# EAGLE schematic sumo1 (EAGLE 8.3.2)
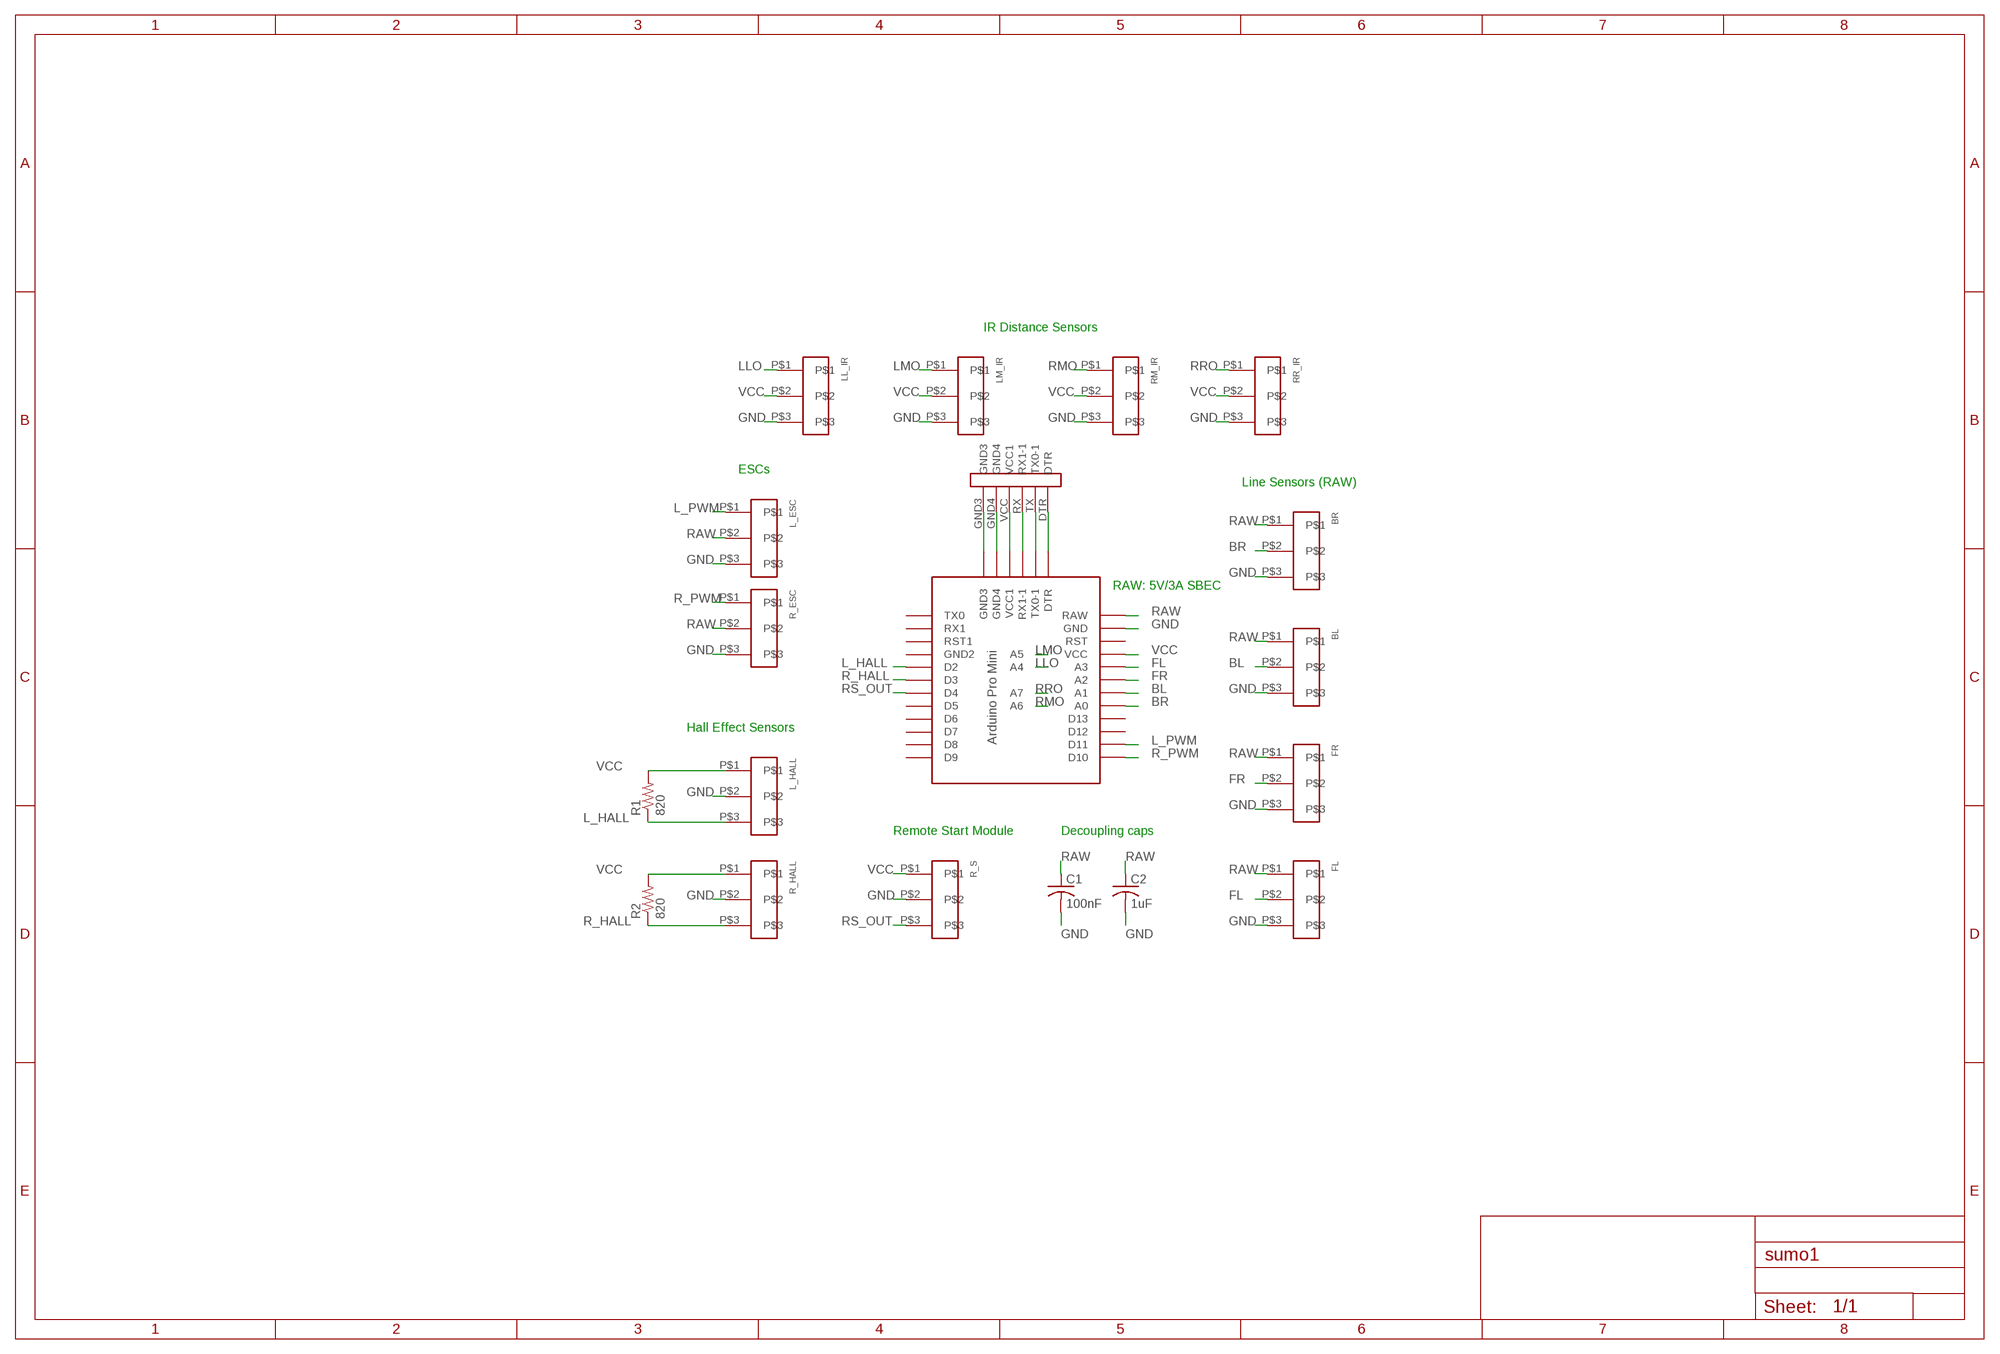
[diagram p0: schematic, sheet 1]

## Parts
BL  PHOENIX_CONTACT_3PIN  [PHOENIX_CONTACT_3PIN]
BR  PHOENIX_CONTACT_3PIN  [PHOENIX_CONTACT_3PIN]
C1  100nF  C-USC0603  [C0603]
C2  1uF  C-USC0603  [C0603]
FL  PHOENIX_CONTACT_3PIN  [PHOENIX_CONTACT_3PIN]
FR  PHOENIX_CONTACT_3PIN  [PHOENIX_CONTACT_3PIN]
L_ESC  PHOENIX_CONTACT_3PIN  [PHOENIX_CONTACT_3PIN]
L_HALL  PHOENIX_CONTACT_3PIN  [PHOENIX_CONTACT_3PIN]
LL_IR  PHOENIX_CONTACT_3PIN  [PHOENIX_CONTACT_3PIN]
LM_IR  PHOENIX_CONTACT_3PIN  [PHOENIX_CONTACT_3PIN]
R1  820  R-US_R0603  [R0603]
R2  820  R-US_R0603  [R0603]
R_ESC  PHOENIX_CONTACT_3PIN  [PHOENIX_CONTACT_3PIN]
R_HALL  PHOENIX_CONTACT_3PIN  [PHOENIX_CONTACT_3PIN]
R_S  PHOENIX_CONTACT_3PIN  [PHOENIX_CONTACT_3PIN]
RM_IR  PHOENIX_CONTACT_3PIN  [PHOENIX_CONTACT_3PIN]
RR_IR  PHOENIX_CONTACT_3PIN  [PHOENIX_CONTACT_3PIN]
U$1  PRO-MINI-2  [PRO-MINI-2]
U$2  6-PIN  [6-PIN]

## Nets
BL: BL.P$2 U$1.A1
BR: BR.P$2 U$1.A0
FL: FL.P$2 U$1.A3
FR: FR.P$2 U$1.A2
GND: BL.P$3 BR.P$3 C1.2 C2.2 FL.P$3 FR.P$3 L_ESC.P$3 L_HALL.P$2 LL_IR.P$3 LM_IR.P$3 R_ESC.P$3 R_HALL.P$2 R_S.P$2 RM_IR.P$3 RR_IR.P$3 U$1.GND
L_HALL: L_HALL.P$3 R1.1 U$1.D2
L_PWM: L_ESC.P$1 U$1.D11
LLO: LL_IR.P$1 U$1.A4
LMO: LM_IR.P$1 U$1.A5
N$1: U$1.GND2(GND3) U$2.GND3
N$2: U$1.GND3(GND4) U$2.GND4
N$3: U$1.VCC1 U$2.VCC(VCC1)
N$4: U$1.RX1-1 U$2.RX(RX1-1)
N$5: U$1.TX0-1 U$2.TX(TX0-1)
N$6: U$1.DTR U$2.DTR
R_HALL: R2.1 R_HALL.P$3 U$1.D3
R_PWM: R_ESC.P$1 U$1.D10
RAW: BL.P$1 BR.P$1 C1.1 C2.1 FL.P$1 FR.P$1 L_ESC.P$2 R_ESC.P$2 U$1.RAW
RMO: RM_IR.P$1 U$1.A6
RRO: RR_IR.P$1 U$1.A7
RS_OUT: R_S.P$3 U$1.D4
VCC: L_HALL.P$1 LL_IR.P$2 LM_IR.P$2 R1.2 R2.2 R_HALL.P$1 R_S.P$1 RM_IR.P$2 RR_IR.P$2 U$1.VCC
Unconnected: U$1.D5 U$1.D6 U$1.D7 U$1.D8 U$1.D9 U$1.D12 U$1.D13 U$1.GND1(GND2) U$1.RST U$1.RST1 U$1.RX1 U$1.TX0

## Notes on the sheet
- IR Distance Sensors
- ESCs
- Line Sensors (RAW)
- RAW: 5V/3A SBEC
- Hall Effect Sensors
- Remote Start Module | Decoupling caps

## Library data of the parts
BL BR FL FR L_ESC L_HALL LL_IR LM_IR R_ESC R_HALL R_S RM_IR RR_IR = Phoenix_Contact_3pin:PHOENIX_CONTACT_3PIN
C1 C2 = rcl:C-US: CAPACITOR, American symbol
R1 R2 = resistor:R-US_: RESISTOR, American symbol
U$1 = Arduino-clone:PRO-MINI-2: Arduino Pro Mini Layout 2 Sparkfun.com
U$2 = 6_PIN:6-PIN